# EAGLE board MCU (EAGLE 8.7.1)
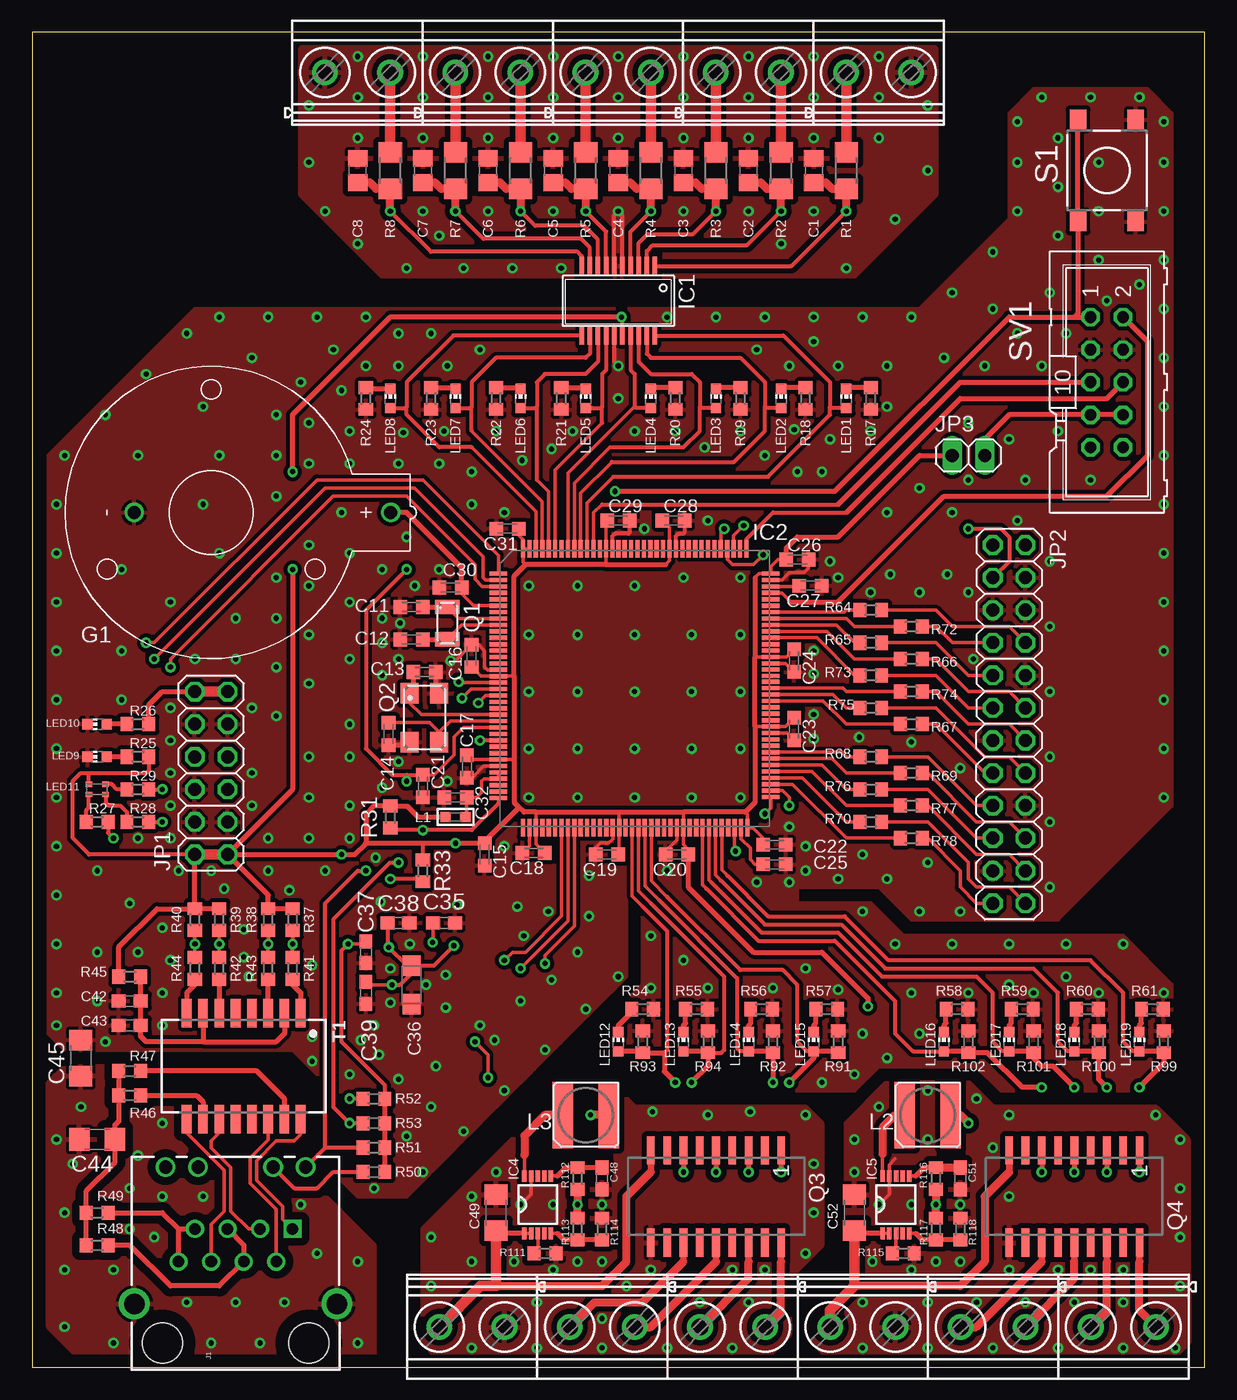
[diagram p6: board, top side]
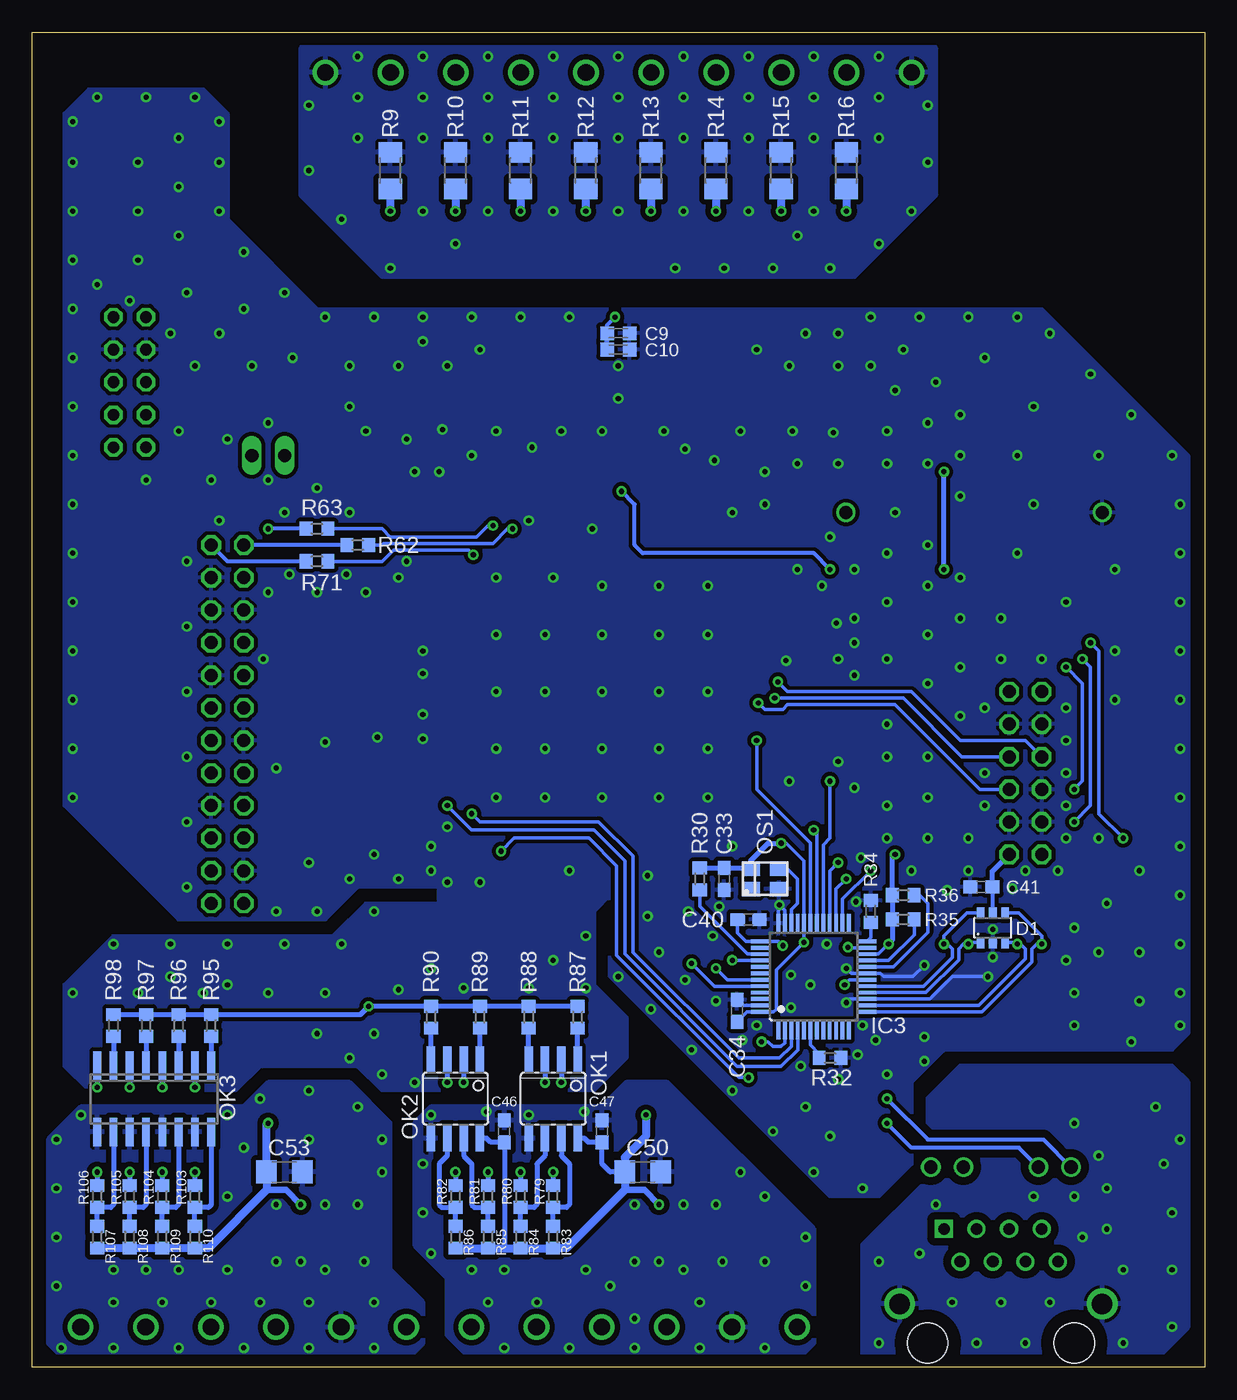
[diagram p7: board, bottom side, seen from below]

Size 91.44 x 104.14 mm. Coordinates in mm from the lower left corner, seen from the top.
Outline: 0,0 91.44,0 91.44,104.14 0,104.14 0,0
Copper layers (1*16): Top 0.035mm / dielectric 1.5mm / Bottom 0.035mm
Design rules "default *": minimum track width 6mil, minimum drill 0.4mm, track to track 8mil, track to pad 8mil, pad to pad 8mil, via to via 12mil, smd to smd 6mil, copper to edge 1mm, drill to drill 10mil, minimum pad ring 10mil, minimum via ring 8mil, stop-mask expansion 4mil, vias tented up to drill 0mil, thermal gap 10mil
Net classes: 0 default: width 0.254 mm; 1 diff pair: width 0.254 mm, clearance 0.254 mm

## Footprints (pad centres in the part's own frame; a part is rotated, then mirrored left to right if it is on the bottom)
C0805 = smd 1.3 x 1.5: 1 -0.95,0; 2 0.95,0
C0603K = smd 1.05 x 1.08: 1 -0.875,0; 2 0.875,0
C0603 = smd 1.1 x 1: 1 -0.85,0; 2 0.85,0
SMC_A = smd 1.6 x 1.4: + -1.5,0; - 1.5,0
C1206 = smd 1.6 x 1.8: 1 -1.4,0; 2 1.4,0
SOT23-6 = smd 0.6 x 0.9: 1 -0.95,-1.15; 2 0,-1.15; 3 0.95,-1.15; 4 0.95,1.15; 5 0,1.15; 6 -0.95,1.15
CH25-2032LF = drill 1: + 0,-14; - 0,6
QSOP-20 = smd 0.35 x 1.45: 1 -2.857,-2.7; 2 -2.222,-2.7; 3 -1.587,-2.7; 4 -0.952,-2.7; 5 -0.317,-2.7; 6 0.318,-2.7; 7 0.953,-2.7; 8 1.588,-2.7; 9 2.223,-2.7; 10 2.858,-2.7; 11 2.857,2.7; 12 2.222,2.7; 13 1.587,2.7; 14 0.952,2.7; 15 0.317,2.7; 16 -0.318,2.7; 17 -0.953,2.7; 18 -1.588,2.7; 19 -2.223,2.7; 20 -2.858,2.7
LQFP144 = smd 1.35 x 0.33: 1 -10.625,9.2; 2 -10.625,8.7; 3 -10.625,8.2; 4 -10.625,7.7; 5 -10.625,7.2; 6 -10.625,6.7; 7 -10.625,6.2; 8 -10.625,5.7; 9 -10.625,5.2; 10 -10.625,4.7; 11 -10.625,4.2; 12 -10.625,3.7; 13 -10.625,3.2; 14 -10.625,2.7; 15 -10.625,2.2; 16 -10.625,1.7; 17 -10.625,1.2; 18 -10.625,0.7; 19 -10.625,0.2; 20 -10.625,-0.3; 21 -10.625,-0.8; 22 -10.625,-1.3; 23 -10.625,-1.8; 24 -10.625,-2.3; 25 -10.625,-2.8; 26 -10.625,-3.3; 27 -10.625,-3.8; 28 -10.625,-4.3; 29 -10.625,-4.8; 30 -10.625,-5.3; 31 -10.625,-5.8; 32 -10.625,-6.3; 33 -10.625,-6.8; 34 -10.625,-7.3; 35 -10.625,-7.8; 36 -10.625,-8.3; 73 10.625,-8.225; 74 10.625,-7.725; 75 10.625,-7.225; 76 10.625,-6.725; 77 10.625,-6.225; 78 10.625,-5.725; 79 10.625,-5.225; 80 10.625,-4.725; 81 10.625,-4.225; 82 10.625,-3.725; 83 10.625,-3.225; 84 10.625,-2.725; 85 10.625,-2.225; 86 10.625,-1.725; 87 10.625,-1.225; 88 10.625,-0.725; 89 10.625,-0.225; 90 10.625,0.275; 91 10.625,0.775; 92 10.625,1.225; 93 10.625,1.725; 94 10.625,2.2; 95 10.625,2.7; 96 10.625,3.2; 97 10.625,3.7; 98 10.625,4.2; 99 10.625,4.7; 100 10.625,5.2; 101 10.625,5.7; 102 10.625,6.2; 103 10.625,6.7; 104 10.625,7.2; 105 10.625,7.7; 106 10.625,8.2; 107 10.625,8.7; 108 10.625,9.2 | smd 0.33 x 1.35: 37 -8.7,-10.625; 38 -8.2,-10.625; 39 -7.7,-10.625; 40 -7.2,-10.625; 41 -6.7,-10.625; 42 -6.2,-10.625; 43 -5.7,-10.625; 44 -5.2,-10.625; 45 -4.7,-10.625; 46 -4.2,-10.625; 47 -3.7,-10.625; 48 -3.2,-10.625; 49 -2.7,-10.625; 50 -2.2,-10.625; 51 -1.7,-10.625; 52 -1.2,-10.625; 53 -0.7,-10.625; 54 -0.2,-10.625; 55 0.3,-10.625; 56 0.8,-10.625; 57 1.3,-10.625; 58 1.8,-10.625; 59 2.3,-10.625; 60 2.8,-10.625; 61 3.3,-10.625; 62 3.8,-10.625; 63 4.3,-10.625; 64 4.8,-10.625; 65 5.3,-10.625; 66 5.8,-10.625; 67 6.3,-10.625; 68 6.8,-10.625; 69 7.3,-10.625; 70 7.8,-10.625; 71 8.3,-10.625; 72 8.8,-10.625; 109 8.725,11.125; 110 8.225,11.125; 111 7.725,11.125; 112 7.225,11.125; 113 6.725,11.125; 114 6.225,11.125; 115 5.725,11.125; 116 5.225,11.125; 117 4.725,11.125; 118 4.225,11.125; 119 3.725,11.125; 120 3.225,11.125; 121 2.725,11.125; 122 2.225,11.125; 123 1.725,11.125; 124 1.225,11.125; 125 0.725,11.125; 126 0.225,11.125; 127 -0.275,11.125; 128 -0.775,11.125; 129 -1.275,11.125; 130 -1.725,11.125; 131 -2.225,11.125; 132 -2.7,11.125; 133 -3.2,11.125; 134 -3.7,11.125; 135 -4.2,11.125; 136 -4.7,11.125; 137 -5.2,11.125; 138 -5.7,11.125; 139 -6.2,11.125; 140 -6.7,11.125; 141 -7.2,11.125; 142 -7.7,11.125; 143 -8.2,11.125; 144 -8.7,11.125
LQFP48 = smd 1.5 x 0.3: 1 -4.15,2.75; 2 -4.15,2.25; 3 -4.15,1.75; 4 -4.15,1.25; 5 -4.15,0.75; 6 -4.15,0.25; 7 -4.15,-0.25; 8 -4.15,-0.75; 9 -4.15,-1.25; 10 -4.15,-1.75; 11 -4.15,-2.25; 12 -4.15,-2.75; 25 4.15,-2.75; 26 4.15,-2.25; 27 4.15,-1.75; 28 4.15,-1.25; 29 4.15,-0.75; 30 4.15,-0.25; 31 4.15,0.25; 32 4.15,0.75; 33 4.15,1.25; 34 4.15,1.75; 35 4.15,2.25; 36 4.15,2.75 | smd 0.3 x 1.5: 13 -2.75,-4.15; 14 -2.25,-4.15; 15 -1.75,-4.15; 16 -1.25,-4.15; 17 -0.75,-4.15; 18 -0.25,-4.15; 19 0.25,-4.15; 20 0.75,-4.15; 21 1.25,-4.15; 22 1.75,-4.15; 23 2.25,-4.15; 24 2.75,-4.15; 37 2.75,4.15; 38 2.25,4.15; 39 1.75,4.15; 40 1.25,4.15; 41 0.75,4.15; 42 0.25,4.15; 43 -0.25,4.15; 44 -0.75,4.15; 45 -1.25,4.15; 46 -1.75,4.15; 47 -2.25,4.15; 48 -2.75,4.15
TSSOP-10(10UMAX) = smd 0.9 x 0.35: 1 -2.875,0.975; 2 -2.875,0.452; 3 -2.875,-0.071; 4 -2.875,-0.594; 5 -2.875,-1.102; 6 1.605,-1.102; 7 1.605,-0.594; 8 1.605,-0.071; 9 1.605,0.452; 10 1.605,0.975
MAGJACK-19938 = drill 0.9 square: 1 0,0 | drill 0.9: 2 -2.54,1.27; 3 0,2.54; 4 -2.54,3.81; 5 0,5.08; 6 -2.54,6.35; 7 0,7.62; 8 -2.54,8.89 | drill 1.02: 9 4.83,-1.02; 10 4.83,1.52; 11 4.83,7.37; 12 4.83,9.91 | drill 1.6: HOLE1 -5.84,12.345; HOLE2 -5.84,-3.455 | hole 3.15: -8.89,-1.27; -8.89,10.16
2X06 = drill 1.016 octagon: 1 -6.35,-1.27; 2 -6.35,1.27; 3 -3.81,-1.27; 4 -3.81,1.27; 5 -1.27,-1.27; 6 -1.27,1.27; 7 1.27,-1.27; 8 1.27,1.27; 9 3.81,-1.27; 10 3.81,1.27; 11 6.35,-1.27; 12 6.35,1.27
2X12 = drill 1.016 octagon: 1 -13.97,-1.27; 2 -13.97,1.27; 3 -11.43,-1.27; 4 -11.43,1.27; 5 -8.89,-1.27; 6 -8.89,1.27; 7 -6.35,-1.27; 8 -6.35,1.27; 9 -3.81,-1.27; 10 -3.81,1.27; 11 -1.27,-1.27; 12 -1.27,1.27; 13 1.27,-1.27; 14 1.27,1.27; 15 3.81,-1.27; 16 3.81,1.27; 17 6.35,-1.27; 18 6.35,1.27; 19 8.89,-1.27; 20 8.89,1.27; 21 11.43,-1.27; 22 11.43,1.27; 23 13.97,-1.27; 24 13.97,1.27
1X02 = drill 1.016 long: 1 -1.27,0; 2 1.27,0
L0603 = smd 0.8 x 0.8: 1 -0.762,0; 2 0.762,0
SRR4528A = smd 1.6 x 5.2: 1 -1.8,0; 2 1.8,0
CHIP-LED0603 = smd 0.8 x 0.8: A 0,-0.75; C 0,0.75
APHF1608SEEQBDZGKC = smd 0.4 x 0.5: 1 0.4,0.65; 2 -0.4,0.65; 3 -0.4,-0.65; 4 0.4,-0.65
SOIC08 = smd 0.66 x 2.032: 1 -1.905,-3.073; 2 -0.635,-3.073; 3 0.635,-3.073; 4 1.905,-3.073; 5 1.905,3.073; 6 0.635,3.073; 7 -0.635,3.073; 8 -1.905,3.073
SO16 = smd 0.6 x 2.2: 1 -4.445,-2.6; 2 -3.175,-2.6; 3 -1.905,-2.6; 4 -0.635,-2.6; 5 0.635,-2.6; 6 1.905,-2.6; 7 3.175,-2.6; 8 4.445,-2.6; 9 4.445,2.6; 10 3.175,2.6; 11 1.905,2.6; 12 0.635,2.6; 13 -0.635,2.6; 14 -1.905,2.6; 15 -3.175,2.6; 16 -4.445,2.6
3.4X2.7-4-PAD = smd 1.4 x 1.15: 1 -1.1,-0.8; 2 1.1,-0.8; 3 1.1,0.8; 4 -1.1,0.8
CRYSTAL_3.5X1.5 = smd 1.1 x 1.9: 1 -1.25,0; 2 1.25,0
CRYSTAL_5X3.2 = smd 1.6 x 1.4: 1 -1.9,-1.15; 2 1.91,-1.15; 3 1.91,1.15; 4 -1.9,1.15
SOP18 = smd 0.6 x 2.2: 1 -5.08,-3.6; 2 -3.81,-3.6; 3 -2.54,-3.6; 4 -1.27,-3.6; 5 0,-3.6; 6 1.27,-3.6; 7 2.54,-3.6; 8 3.81,-3.6; 9 5.08,-3.6; 10 5.08,3.6; 11 3.81,3.6; 12 2.54,3.6; 13 1.27,3.6; 14 0,3.6; 15 -1.27,3.6; 16 -2.54,3.6; 17 -3.81,3.6; 18 -5.08,3.6
R1206 = smd 1.6 x 1.803: 1 -1.422,0; 2 1.422,0
R0603 = smd 1 x 1.1: 1 -0.85,0; 2 0.85,0
DTSM-6 = smd 1.55 x 1.3: 1 -3.975,2.25; 2 3.975,2.25; 3 -3.975,-2.25; 4 3.975,-2.25
ML10 = drill 0.914 octagon: 1 -5.08,-1.27; 2 -5.08,1.27; 3 -2.54,-1.27; 4 -2.54,1.27; 5 0,-1.27; 6 0,1.27; 7 2.54,-1.27; 8 2.54,1.27; 9 5.08,-1.27; 10 5.08,1.27
HXXXX = smd 0.76 x 2.2: 1 -4.445,-4.128; 2 -3.175,-4.128; 3 -1.905,-4.128; 4 -0.635,-4.128; 5 0.635,-4.128; 6 1.905,-4.128; 7 3.175,-4.128; 8 4.445,-4.128; 9 4.445,4.128; 10 3.175,4.128; 11 1.905,4.128; 12 0.635,4.128; 13 -0.635,4.128; 14 -1.905,4.128; 15 -3.175,4.128; 16 -4.445,4.128
MKDSN1,5/2-5,08 = drill 1.3 pad 2: 1 -2.561,0.025; 2 2.519,0.025

## Placement (x,y rotation side)
C1  2.2nF  [C0805]  60.96,93.34 90 top
C2  2.2nF  [C0805]  55.88,93.34 90 top
C3  2.2nF  [C0805]  50.8,93.34 90 top
C4  2.2nF  [C0805]  45.72,93.34 90 top
C5  2.2nF  [C0805]  40.64,93.34 90 top
C6  2.2nF  [C0805]  35.56,93.34 90 top
C7  2.2nF  [C0805]  30.48,93.34 90 top
C8  2.2nF  [C0805]  25.4,93.34 90 top
C9  100nF  [C0603K]  45.72,80.64 0 bottom
C10  1uF  [C0603K]  45.72,79.38 0 bottom
C11  10pF  [C0603K]  29.59,59.31 180 top
C12  10pF  [C0603K]  29.59,56.77 180 top
C13  22pF  [C0603K]  30.61,54.23 0 top
C14  22pF  [C0603K]  27.81,49.4 270 top
C15  4.7uF  [C0603K]  35.31,40.01 270 top
C16  100nF  [C0603K]  34.29,55.5 90 top
C17  100nF  [C0603K]  33.91,46.86 270 top
C18  100nF  [C0603K]  39.12,40.13 180 top
C19  100nF  [C0603K]  44.83,40.01 180 top
C20  100nF  [C0603K]  50.29,40.01 180 top
C21  100nF  [C0603K]  30.48,45.34 270 top
C22  100nF  [C0603K]  57.91,40.77 0 top
C23  100nF  [C0603K]  59.44,49.78 270 top
C24  100nF  [C0603K]  59.44,55.12 270 top
C25  2.2uF  [C0603K]  57.91,39.24 180 top
C26  100nF  [C0603K]  59.69,62.99 0 top
C27  2.2uF  [C0603K]  60.71,60.96 180 top
C28  100nF  [C0603K]  50.04,66.04 0 top
C29  100nF  [C0603K]  45.72,66.04 0 top
C30  1uF  [C0603K]  32.64,60.83 180 top
C31  100nF  [C0603K]  37.08,65.41 180 top
C32  100nF  [C0603K]  33.02,44.45 180 top
C33  100nF  [C0603]  37.47,38.1 270 bottom
C34  100nF  [C0603]  36.45,27.81 90 bottom
C35  100nF  [C0603]  32.13,34.67 0 top
C36  10uF  [SMC_A]  29.59,29.84 270 top
C37  100nF  [C0603]  26.04,32.38 270 top
C38  100nF  [C0603]  28.57,34.67 0 top
C39  100nF  [C0603]  26.04,29.21 270 top
C40  100nF  [C0603]  35.56,34.92 0 bottom
C41  100nF  [C0603]  17.4,37.47 180 bottom
C42  100nF  [C0603]  7.62,28.57 180 top
C43  100nF  [C0603]  7.62,26.67 180 top
C44  1nF, 2kV  [C1206]  5.08,17.78 180 top
C45  1nF, 2kV  [C1206]  3.81,24.13 270 top
C46  100nF  [C0603]  54.61,18.41 90 bottom
C47  100nF  [C0603]  46.99,18.41 90 bottom
C48  0,22uF  [C0603]  44.45,14.73 270 top
C49  1uF/50V  [C1206]  36.2,12.06 90 top
C50  10uF/6,3V  [C1206]  43.81,15.24 0 bottom
C51  0,22uF  [C0603]  72.39,14.73 270 top
C52  1uF/50V  [C1206]  64.14,12.06 90 top
C53  10uF/6,3V  [C1206]  71.75,15.24 0 bottom
D1  USBLC6-4SC6  [SOT23-6]  16.51,34.29 0 bottom
G1  CH25-2032LF  [CH25-2032LF]  13.97,66.67 90 top
IC1  SI8382P-IU  [QSOP-20]  45.72,83.19 180 top
IC2  [LQFP144]  46.99,52.7 0 top
IC3  DP83848  [LQFP48]  30.48,30.48 90 bottom
IC4  MAX17552  [TSSOP-10(10UMAX)]  39.37,13.34 90 top
IC5  MAX17552  [TSSOP-10(10UMAX)]  67.31,13.34 90 top
J1  RJHSE-5381  [MAGJACK-19938]  20.32,10.79 90 top
JP1  [2X06]  13.97,46.35 90 top
JP2  [2X12]  76.2,50.16 270 top
JP3  [1X02]  73.03,71.12 0 top
L1  600R  [L0603]  33.02,42.93 180 top
L2  220uH  [SRR4528A]  69.85,19.68 0 top
L3  220uH  [SRR4528A]  43.18,19.68 0 top
LED1  [CHIP-LED0603]  63.5,75.56 0 top
LED2  [CHIP-LED0603]  58.42,75.56 0 top
LED3  [CHIP-LED0603]  53.34,75.56 0 top
LED4  [CHIP-LED0603]  48.26,75.56 0 top
LED5  [CHIP-LED0603]  43.18,75.56 0 top
LED6  [CHIP-LED0603]  38.1,75.56 0 top
LED7  [CHIP-LED0603]  33.02,75.56 0 top
LED8  [CHIP-LED0603]  27.94,75.56 0 top
LED9  [CHIP-LED0603]  5.08,47.62 90 top
LED10  [CHIP-LED0603]  5.08,50.16 90 top
LED11  APHF1608SEEQBDZGKC  [APHF1608SEEQBDZGKC]  5.08,45.09 90 top
LED12  [CHIP-LED0603]  45.72,25.4 0 top
LED13  [CHIP-LED0603]  50.8,25.4 0 top
LED14  [CHIP-LED0603]  55.88,25.4 0 top
LED15  [CHIP-LED0603]  60.96,25.4 0 top
LED16  [CHIP-LED0603]  71.12,25.4 0 top
LED17  [CHIP-LED0603]  76.2,25.4 0 top
LED18  [CHIP-LED0603]  81.28,25.4 0 top
LED19  [CHIP-LED0603]  86.36,25.4 0 top
OK1  HCPL0531  [SOIC08]  50.8,20.95 180 bottom
OK2  HCPL0531  [SOIC08]  58.42,20.95 180 bottom
OK3  TLP291-4  [SO16]  81.92,20.95 180 bottom
OS1  CFPS-39-CFPS-39  [3.4X2.7-4-PAD]  34.29,38.1 0 bottom
Q1  32.768kHz  [CRYSTAL_3.5X1.5]  32.38,58.04 270 top
Q2  CRYSTAL_SHIELD  [CRYSTAL_5X3.2]  30.61,50.67 270 top
Q3  MIC2981/82  [SOP18]  53.34,13.34 180 top
Q4  MIC2981/82  [SOP18]  81.28,13.34 180 top
R1  6.2k  [R1206]  63.5,93.34 270 top
R2  6.2k  [R1206]  58.42,93.34 270 top
R3  6.2k  [R1206]  53.34,93.34 270 top
R4  6.2k  [R1206]  48.26,93.34 270 top
R5  6.2k  [R1206]  43.18,93.34 270 top
R6  6.2k  [R1206]  38.1,93.34 270 top
R7  6.2k  [R1206]  33.02,93.34 270 top
R8  6.2k  [R1206]  27.94,93.34 270 top
R9  2.4k  [R1206]  63.5,93.34 270 bottom
R10  2.4k  [R1206]  58.42,93.34 270 bottom
R11  2.4k  [R1206]  53.34,93.34 270 bottom
R12  2.4k  [R1206]  48.26,93.34 270 bottom
R13  2.4k  [R1206]  43.18,93.34 270 bottom
R14  2.4k  [R1206]  38.1,93.34 270 bottom
R15  2.4k  [R1206]  33.02,93.34 270 bottom
R16  2.4k  [R1206]  27.94,93.34 270 bottom
R17  1.2k  [R0603]  65.41,75.56 270 top
R18  1.2k  [R0603]  60.33,75.56 270 top
R19  1.2k  [R0603]  55.24,75.56 270 top
R20  1.2k  [R0603]  50.16,75.56 270 top
R21  1.2k  [R0603]  41.27,75.56 270 top
R22  1.2k  [R0603]  36.2,75.56 270 top
R23  1.2k  [R0603]  31.11,75.56 270 top
R24  1.2k  [R0603]  26.04,75.56 270 top
R25  1.2k  [R0603]  8.26,47.62 180 top
R26  22k  [R0603]  8.26,50.16 180 top
R27  1.2k  [R0603]  5.08,42.55 0 top
R28  1.2k  [R0603]  8.26,42.55 0 top
R29  1.2k  [R0603]  8.26,45.09 0 top
R30  2K2  [R0603]  39.37,38.1 90 bottom
R31  1K5  [R0603]  27.94,42.93 270 top
R32  2K2  [R0603]  29.21,24.13 180 bottom
R33  2K2  [R0603]  30.48,38.73 90 top
R34  4K87, 1%  [R0603]  26.04,35.56 90 bottom
R35  2K2  [R0603]  23.5,34.92 180 bottom
R36  2K2  [R0603]  23.5,36.83 180 bottom
R37  49.9R  [R0603]  20.32,34.92 90 top
R38  49.9R  [R0603]  18.41,34.92 90 top
R39  49.9R  [R0603]  14.61,34.92 90 top
R40  49.9R  [R0603]  12.7,34.92 90 top
R41  0R  [R0603]  20.32,31.11 270 top
R42  0R  [R0603]  14.61,31.11 270 top
R43  0R  [R0603]  18.41,31.11 270 top
R44  0R  [R0603]  12.7,31.11 270 top
R45  0R  [R0603]  7.62,30.48 180 top
R46  75R  [R0603]  7.62,21.21 0 top
R47  75R  [R0603]  7.62,23.11 0 top
R48  75R  [R0603]  5.08,9.53 0 top
R49  75R  [R0603]  5.08,12.06 0 top
R50  110R  [R0603]  26.67,15.24 0 top
R51  2K2  [R0603]  26.67,17.14 0 top
R52  110R  [R0603]  26.67,20.95 0 top
R53  2K2  [R0603]  26.67,19.05 0 top
R54  1.2k  [R0603]  47.62,27.94 0 top
R55  1.2k  [R0603]  51.82,27.94 0 top
R56  1.2k  [R0603]  56.9,27.94 0 top
R57  1.2k  [R0603]  61.98,27.94 0 top
R58  1.2k  [R0603]  72.14,27.94 0 top
R59  1.2k  [R0603]  77.22,27.94 0 top
R60  1.2k  [R0603]  82.3,27.94 0 top
R61  1.2k  [R0603]  87.38,27.94 0 top
R62  33R  [R0603]  66.04,64.14 180 bottom
R63  33R  [R0603]  69.22,65.41 180 bottom
R64  33R  [R0603]  68.58,57.78 0 top
R65  33R  [R0603]  65.41,56.52 0 top
R66  33R  [R0603]  65.41,53.98 0 top
R67  33R  [R0603]  68.58,50.16 0 top
R68  33R  [R0603]  65.41,47.62 0 top
R69  33R  [R0603]  65.41,45.09 0 top
R70  33R  [R0603]  68.58,41.27 0 top
R71  33R  [R0603]  69.22,62.87 0 bottom
R72  33R  [R0603]  65.41,59.05 180 top
R73  33R  [R0603]  68.58,55.24 180 top
R74  33R  [R0603]  68.58,52.7 180 top
R75  33R  [R0603]  65.41,51.44 180 top
R76  33R  [R0603]  68.58,46.35 180 top
R77  33R  [R0603]  68.58,43.81 180 top
R78  33R  [R0603]  65.41,42.55 180 top
R79  300R  [R0603]  50.8,13.34 90 bottom
R80  300R  [R0603]  53.34,13.34 90 bottom
R81  300R  [R0603]  55.88,13.34 90 bottom
R82  300R  [R0603]  58.42,13.34 90 bottom
R83  523R  [R0603]  50.8,10.16 270 bottom
R84  523R  [R0603]  53.34,10.16 270 bottom
R85  523R  [R0603]  55.88,10.16 270 bottom
R86  523R  [R0603]  58.42,10.16 270 bottom
R87  210R  [R0603]  48.9,27.3 270 bottom
R88  210R  [R0603]  52.7,27.3 270 bottom
R89  210R  [R0603]  56.52,27.3 270 bottom
R90  210R  [R0603]  60.33,27.3 270 bottom
R91  2k7  [R0603]  62.87,25.4 270 top
R92  2k7  [R0603]  57.78,25.4 270 top
R93  2k7  [R0603]  47.62,25.4 270 top
R94  2k7  [R0603]  52.7,25.4 270 top
R95  210R  [R0603]  77.47,26.67 270 bottom
R96  210R  [R0603]  80.01,26.67 270 bottom
R97  210R  [R0603]  82.55,26.67 270 bottom
R98  210R  [R0603]  85.09,26.67 270 bottom
R99  2k7  [R0603]  88.27,25.4 270 top
R100  2k7  [R0603]  83.19,25.4 270 top
R101  2k7  [R0603]  78.11,25.4 270 top
R102  2k7  [R0603]  73.03,25.4 270 top
R103  300R  [R0603]  78.74,13.34 90 bottom
R104  300R  [R0603]  81.28,13.34 90 bottom
R105  300R  [R0603]  83.82,13.34 90 bottom
R106  300R  [R0603]  86.36,13.34 90 bottom
R107  523R  [R0603]  86.36,10.16 270 bottom
R108  523R  [R0603]  83.82,10.16 270 bottom
R109  523R  [R0603]  81.28,10.16 270 bottom
R110  523R  [R0603]  78.74,10.16 270 bottom
R111  191k  [R0603]  40.01,8.89 180 top
R112  22k1  [R0603]  42.55,14.73 270 top
R113  261k  [R0603]  42.55,10.79 90 top
R114  49k9  [R0603]  44.45,10.79 270 top
R115  191k  [R0603]  67.94,8.89 180 top
R116  22k1  [R0603]  70.48,14.73 270 top
R117  261k  [R0603]  70.48,10.79 90 top
R118  49k9  [R0603]  72.39,10.79 270 top
S1  DTSM-6  [DTSM-6]  83.82,93.34 270 top
SV1  [ML10]  83.82,76.83 270 top
T1  H1102NL  [HXXXX]  16.51,23.5 180 top
X1  MKDSN1,5/2-5,08  [MKDSN1,5/2-5,08]  25.4,100.97 0 top
X2  MKDSN1,5/2-5,08  [MKDSN1,5/2-5,08]  35.56,100.97 0 top
X3  MKDSN1,5/2-5,08  [MKDSN1,5/2-5,08]  45.72,100.97 0 top
X4  MKDSN1,5/2-5,08  [MKDSN1,5/2-5,08]  34.29,3.17 180 top
X5  MKDSN1,5/2-5,08  [MKDSN1,5/2-5,08]  44.45,3.17 180 top
X6  MKDSN1,5/2-5,08  [MKDSN1,5/2-5,08]  54.61,3.17 180 top
X7  MKDSN1,5/2-5,08  [MKDSN1,5/2-5,08]  64.77,3.17 180 top
X8  MKDSN1,5/2-5,08  [MKDSN1,5/2-5,08]  74.93,3.17 180 top
X9  MKDSN1,5/2-5,08  [MKDSN1,5/2-5,08]  85.09,3.17 180 top
X10  MKDSN1,5/2-5,08  [MKDSN1,5/2-5,08]  55.88,100.97 0 top
X11  MKDSN1,5/2-5,08  [MKDSN1,5/2-5,08]  66.04,100.97 0 top

## Tracks (layer width: path | path; a pad name or v marks a point on that pad's centre or on a via)
5-24V1
  Top 0.254: IC4.2 IC4.1
  Top 0.406: IC4.1 36.4,10.46 C49.1
  Top 0.508: 48.26,15.24 Q3.9
  Top 0.61: 36.2,6.35 44.45,6.35 46.35,8.26 46.35,13.34 48.26,15.24
  Top 0.813: C49.1 36.2,6.35 34.97,6.35 X4.2
5-24V2
  Top 0.254: IC5.1 IC5.2
  Top 0.305: 64.34,10.46 C52.1
  Top 0.406: IC5.1 64.34,10.46
  Top 0.508: Q4.9 76.2,15.24
  Top 0.61: 76.2,15.24 74.3,13.34 74.3,8.26 72.39,6.35 64.14,6.35
  Top 0.813: C52.1 64.14,6.35 62.23,4.45 62.23,3.17 X7.2
5V1  (via drill 0.4)
  Top 0.61: R113.2 v42.55,12.7 R112.2 | L3.2 v43.56,19.68
  Bottom 0.406: 54.61,9.31 C46.1 55.66,17.57 55.98,17.88 OK2.8 | C50.1 46.35,15.24 46.99,15.88 C47.1 48.05,17.57 48.36,17.88 OK1.8
  Bottom 0.508: 45.22,13.84 43.69,13.84 v42.55,12.7
  Bottom 0.61: R86.2 R85.2 54.61,9.31 R84.2 R83.2 49.74,9.31 45.22,13.84 C50.1 45.22,16.38 43.56,18.03 v43.56,19.68
5V2  (via drill 0.4)
  Top 0.61: R116.2 v70.48,12.7 R117.2 | L2.2 72.39,19.68 v73.03,19.05
  Bottom 0.508: 73.16,13.84 71.62,13.84 v70.48,12.7
  Bottom 0.61: R107.2 R108.2 R109.2 R110.2 77.69,9.31 73.16,13.84 C53.1 73.16,18.92 v73.03,19.05
+3V3  (via drill 0.4)
  Top 0.254: C18.1 39.29,40.83 IC2.39 39.29,43.31 | C22.1 57.04,41.26 56.22,42.08 IC2.72 55.79,43.14 55.63,43.31 | 49.4,62.61 49.72,62.92 IC2.121 49.72,65.49 C28.1 | IC2.144 38.29,62.8 38.48,62.61 | IC2.143 IC2.144 | 50.8,43.31 50.79,43.3 IC2.62 50.79,40.78 51.17,40.4 | 45.72,43.31 45.79,43.24 IC2.52 45.79,40.09 C19.1 | 37.59,47.41 IC2.30 34.24,47.41 C17.1 | 37.59,53.91 IC2.17 35.01,53.91 C16.1 | 44.77,62.61 IC2.131 44.77,65.96 C29.1 | 56.39,55.41 IC2.95 58.85,55.41 C24.1 | 56.39,49.98 IC2.84 58.76,49.98 C23.1 | 56.39,61.59 56.7,61.91 IC2.108 57.62,62.44 58.17,62.99 C26.1 | C37.1 25.82,33.02 v24.64,33.02 | C35.1 31.28,33.19 v31.24,33.15 | IC2.144 38.29,64.58 37.96,64.91 C31.1
  Top 0.305: IC1.16 46.04,81.85 v45.97,81.92 | R52.2 27.52,22.01 24.13,25.4 24.13,32.51 v24.64,33.02 | 51.17,40.4 C20.1 | R33.2 30.48,40.88 | R25.1 9.11,46.57 8.89,46.35 4.45,46.35 | 4.45,46.35 3.81,46.35 3.17,45.72 3.17,41.27 4.45,40.01 JP1.2 | LED11.1 4.43,46.34 4.45,46.35
  Top 0.406: 37.97,43.69 38.35,43.31 39.29,43.31 45.72,43.31 50.8,43.31 55.63,43.31 56.39,44.07 56.39,49.98 56.39,55.41 56.39,61.59 | 37.97,43.69 37.59,44.07 37.59,47.41 37.59,53.91 37.59,61.72 38.48,62.61 44.77,62.61 49.4,62.61 | C26.1 58.81,63.9 59.69,64.77 62.87,64.77 69.22,71.12 JP3.1 | v45.97,81.92 27.94,81.92 20.32,74.3 v20.32,69.85 | L1.2 30.1,42.93 29.25,43.78 R31.1 26.63,43.78 26.04,43.18 26.04,40.88 | R50.2 R51.2 R53.2 R52.2 | R39.2 R40.2 | R37.2 R38.2 18.41,36.83 JP1.1 | R45.2 6.77,32.8 9.74,35.77 R40.2 | 35.07,40.64 C15.1 | 37.97,43.69 35.31,41.02 C15.1 | C15.1 v33.02,40.88 30.48,40.88 26.04,40.88 | 26.04,40.88 26.01,40.88 | JP1.1 v24.13,40.01 25.16,40.01 26.04,40.88 | JP1.1 20.32,45.09 v20.32,62.23 | R40.2 JP1.2 | C20.1 51.17,37.48 56.26,32.38 61.59,32.38 65.19,28.79 v65.19,28.16
  Top 0.813: JP1.1 JP1.2
  Bottom 0.254: C34.1 35.68,27.73 IC3.48 33.61,27.73 33.4,27.94 33.4,30.99 v31.24,33.15 v31.23,33.16 IC3.32 31.23,39.48 32.62,40.88 v33.02,40.88 | IC3.22 25.43,32.23 v24.64,33.02
  Bottom 0.305: C9.1 46.59,81.29 v45.97,81.92 | D1.5 16.51,37.43 C41.1
  Bottom 0.406: R30.2 C33.1 35.44,38.95 OS1.4 35.39,39.54 34.05,40.88 v33.02,40.88 | v24.64,33.02 24.34,33.31 R35.2 R36.2 24.34,39.79 v24.13,40.01 | C10.1 C9.1 | v20.32,62.23 v20.32,69.85 | C41.1 16.55,38.7 JP1.1 | R87.1 R88.1 R89.1 R90.1 v65.19,28.16 65.83,27.52 R95.1 R96.1 R97.1 R98.1
+24V
  Top 0.406: R26.1 9.11,51.65 10.16,52.7 JP1.12
  Top 0.813: JP1.11 JP1.12
COM  (via drill 0.4)
  Top 0.305: IC1.6 45.4,89.85 v45.72,90.17 46.04,89.85 IC1.5
  other vias: 25.4,95.89 41.27,85.72 37.47,85.72 33.66,85.72 29.21,85.72 25.4,87.63 22.86,90.17 21.59,93.98 30.48,95.89 35.56,95.89 40.64,95.89 45.72,95.89 50.8,95.89 55.88,95.89 60.96,95.89 21.59,98.42 25.4,99.06 30.48,99.06 35.56,99.06 40.64,99.06 45.72,99.06 50.8,99.06 55.88,99.06 60.96,99.06 60.96,90.17 55.88,90.17 50.8,90.17 40.64,90.17 35.56,90.17 30.48,90.17 58.42,87.63 31.75,88.27 67.31,89.53 63.5,85.72 69.85,93.34 66.04,95.89 66.04,99.06 69.85,98.42 66.04,102.23 60.96,102.23 55.88,102.23 50.8,102.23 45.72,102.23 40.64,102.23 35.56,102.23 30.48,102.23 25.4,102.23
  pour Top (isolate 0.406): 70.48,102.87 70.48,91.44 64.14,85.09 27.3,85.09 20.95,91.44 20.95,102.87 22.23,104.14 69.22,104.14
  pour Bottom (isolate 0.406): 70.48,102.87 70.48,91.44 64.14,85.09 27.3,85.09 20.95,91.44 20.95,102.87 22.23,104.14 69.22,104.14
CS_AI1_4
  Top 0.254: IC2.88 61.69,51.98 63.5,50.16 R67.1
CS_AI1_8
  Top 0.254: IC2.89 62.45,52.48 63.5,51.44 R75.2
CS_AI2_4
  Top 0.254: IC2.90 63.23,52.98 63.5,52.7 R74.2
CS_AI2_8
  Top 0.254: IC2.98 61.2,56.91 64.14,53.98 R66.1
CS_AO1_4
  Top 0.254: IC2.99 61.98,57.41 64.14,55.24 R73.2
CS_AO1_8
  Top 0.254: IC2.100 62.74,57.91 64.14,56.52 R65.1
CS_AO2_4
  Top 0.254: IC2.102 63.35,58.91 63.5,59.05 R72.2
CS_AO2_8
  Top 0.254: IC2.101 63.52,58.41 64.14,57.78 R64.1
CS_DI1
  Top 0.254: IC2.75 59.3,45.48 63.5,41.27 R70.1
CS_DI2
  Top 0.254: IC2.77 60.84,46.48 63.5,43.81 R77.2
CS_DO1
  Top 0.254: IC2.79 62.38,47.48 63.5,46.35 R76.2
CS_DO2
  Top 0.254: IC2.80 63.15,47.98 63.5,47.62 R68.1
DI1_INT
  Top 0.254: IC2.76 60.06,45.98 63.5,42.55 R78.2
DI2_INT
  Top 0.254: IC2.78 61.6,46.98 63.5,45.09 R69.1
DI_0
  Top 0.254: IC2.134 43.29,67.42 45.34,69.47
  Top 0.305: IC1.20 58.58,80.48 62.23,76.83 62.23,74.93 | LED1.A 62.34,74.81 62.23,74.93 | 45.34,69.47 57.4,69.47 62.23,74.3 62.23,74.93
DI_1
  Top 0.254: IC2.135 42.79,68.19 45.21,70.61
  Top 0.305: IC1.19 47.94,79.06 48.26,78.74 55.24,78.74 57.15,76.83 57.15,74.93 | LED2.A 57.27,74.81 57.15,74.93 | 45.21,70.61 54.74,70.61 57.15,73.03 57.15,74.93
DI_2
  Top 0.254: IC2.136 42.29,68.96 45.09,71.75
  Top 0.305: IC1.18 47.31,78.42 48.26,77.47 51.44,77.47 52.07,76.83 52.07,74.93 | LED3.A 52.19,74.81 52.07,74.93 | 45.09,71.75 50.8,71.75 52.07,73.03 52.07,74.93
DI_3
  Top 0.254: IC2.137 41.79,69.73 46.99,74.93
  Top 0.305: IC1.17 46.67,77.79 46.99,77.47 46.99,74.93 47.1,74.81 LED4.A
DI_4
  Top 0.254: IC2.139 40.79,70 44.45,73.66
  Top 0.305: IC1.14 44.77,77.79 44.45,77.47 44.45,74.93 | 43.7,74.81 LED5.A 44.34,74.81 44.45,74.93 | 44.45,73.66 44.45,74.93
DI_5
  Top 0.254: IC2.140 40.29,68.3 39.37,69.22
  Top 0.305: IC1.13 44.13,78.42 43.18,77.47 40.01,77.47 39.37,76.83 39.37,74.93 | LED6.A 39.26,74.81 39.37,74.93 | 39.37,69.22 39.37,74.93
DI_6
  Top 0.254: IC2.141 39.79,67.53 34.29,73.03
  Top 0.305: IC1.12 43.5,79.06 43.18,78.74 36.2,78.74 34.29,76.83 34.29,74.93 | LED7.A 34.17,74.81 34.29,74.93 | 34.29,73.03 34.29,74.93
DI_7
  Top 0.254: 34.29,71.75 39.29,66.75 IC2.142
  Top 0.305: IC1.11 32.86,80.48 29.21,76.83 29.21,74.93 | LED8.A 29.09,74.81 29.21,74.93 | 29.21,74.93 29.21,74.3 31.75,71.75 34.29,71.75
DMX_DIR  (via drill 0.4)
  Top 0.254: IC2.20 35.39,52.41 v34.8,51.82
  Bottom 0.254: v34.8,51.82 34.29,51.31 32.89,51.31 32.51,51.69 24.13,51.69 17.53,45.09 JP1.5
DMX_RX  (via drill 0.4)
  Top 0.254: IC2.18 33.34,53.41 v33.27,53.47
  Bottom 0.254: v33.27,53.47 32.51,52.7 22.86,52.7 19.05,48.9 13.97,48.9 JP1.8
DMX_TX  (via drill 0.4)
  Top 0.254: IC2.19 34.24,52.91 v33.53,52.2
  Bottom 0.254: v33.53,52.2 23.5,52.2 18.92,47.62 JP1.7
DO_0  (via drill 0.4)
  Top 0.254: IC2.54 46.79,36.78 47.62,35.94
  Top 0.305: 47.62,35.94 49.53,34.04 49.53,24.77 49.31,24.55
  Top 0.406: LED12.A 47.52,24.65 R93.2 49.31,24.55 49.31,23.07 v50.16,22.23
  Bottom 0.406: OK1.2 v50.16,22.23
DO_1  (via drill 0.4)
  Top 0.254: IC2.55 47.29,37.16 48.26,36.2
  Top 0.305: R94.2 53.76,24.55 53.98,24.77 53.98,30.48 48.26,36.2
  Top 0.406: LED13.A 52.6,24.65 R94.2 52.7,23.5 v51.44,22.23
  Bottom 0.406: OK1.3 v51.44,22.23
DO_2  (via drill 0.4)
  Top 0.254: IC2.56 47.79,37.55 48.9,36.45
  Top 0.305: LED14.A 55.23,24.65 54.99,24.89 54.99,30.35 48.9,36.45
  Top 0.406: LED14.A 57.69,24.65 R92.2 v57.78,22.23
  Bottom 0.406: OK2.2 v57.78,22.23
DO_3  (via drill 0.4)
  Top 0.254: IC2.57 48.29,37.94 49.53,36.7
  Top 0.305: 49.53,36.7 55.24,30.99 58.55,30.99 59.69,29.84 59.69,25.4 60.44,24.65 LED15.A
  Top 0.406: v59.05,22.23 60.96,24.13 LED15.A 62.77,24.65 R91.2
  Bottom 0.406: OK2.3 v59.05,22.23
DO_4  (via drill 0.4)
  Top 0.254: IC2.65 52.29,37.63 52.58,37.34
  Top 0.305: 52.58,37.34 56.64,33.27 62.61,33.27 67.31,28.57 67.31,26.04 68.69,24.65 LED16.A
  Top 0.406: v78.74,21.84 77.22,21.84 74.51,24.55 R102.2 72.92,24.65 LED16.A
  Bottom 0.406: OK3.2 v78.74,21.84
DO_5  (via drill 0.4)
  Top 0.254: IC2.66 52.79,38.02 52.96,37.85
  Top 0.305: 52.96,37.85 56.9,33.91 62.87,33.91 66.29,30.48 73.66,30.48 74.93,29.21 74.93,25.4 75.68,24.65 LED17.A
  Top 0.406: v81.28,21.84 79.63,23.5 78.74,23.5 78.11,24.13 R101.2 78,24.65 LED17.A
  Bottom 0.406: OK3.4 v81.28,21.84
DO_6  (via drill 0.4)
  Top 0.254: IC2.67 53.29,38.4 53.72,37.97
  Top 0.305: 53.72,37.97 57.15,34.54 63.12,34.54 66.55,31.11 78.11,31.11 80.01,29.21 80.01,25.4 80.76,24.65 LED18.A
  Top 0.406: v83.82,21.84 83.19,22.48 R100.2 83.08,24.65 LED18.A
  Bottom 0.406: OK3.6 v83.82,21.84
DO_7  (via drill 0.4)
  Top 0.254: IC2.68 53.79,38.79 54.23,38.35
  Top 0.305: 54.23,38.35 57.4,35.18 63.37,35.18 66.8,31.75 82.55,31.75 85.09,29.21 85.09,25.4 85.84,24.65 LED19.A
  Top 0.406: LED19.A 88.17,24.65 R99.2 88.27,23.75 v86.36,21.84
  Bottom 0.406: OK3.8 v86.36,21.84
GND  (via drill 0.4)
  Top 0.254: IC2.38 38.79,40.68 C18.2 | IC2.31 35.22,46.91 34.3,45.99 C17.2 | IC2.107 58.48,61.41 59.05,61.98 60.2,61.98 60.56,62.34 C26.2 | IC2.94 58.77,54.91 C24.2 | IC2.83 58.87,49.48 C23.2 | IC2.61 50.29,41.15 49.42,40.27 | IC2.51 45.29,41.23 44.96,40.89 44.32,40.89 43.96,40.53 C19.2 | IC2.16 35.51,54.41 35.31,54.61 35.31,55.88 34.81,56.37 C16.2 33.03,55.12 v32.64,55.12
  Top 0.305: IC1.15 45.4,78.42 v45.72,78.11 | 49.42,40.27 C20.2 | IC2.130 45.27,64.82 45.47,65.02 46.48,65.02 46.59,65.14 C29.2 | IC2.120 50.22,64.82 50.42,65.02 50.77,65.02 50.91,65.17 C28.2
  Top 0.406: C14.2 29.22,48.53 Q2.2 | C13.2 31.48,52.85 Q2.4
  Bottom 0.254: IC3.47 36.02,28.23 C34.2 | IC3.35 32.73,35.65 v33.15,36.07 33.23,35.98 IC3.36 | v21.84,31.37 22.73,30.48 25.02,30.48 25.27,30.73 IC3.19 27.55,30.73 v27.94,31.11 | v27.94,28.45 27.66,28.73 IC3.15 21.43,28.73 19.68,30.48 v16.89,30.48
  other vias: 60.96,54.1 55.24,44.45 38.73,44.45 42.55,44.45 51.44,44.45 46.99,44.45 55.24,48.26 38.73,48.26 42.55,48.26 51.44,48.26 46.99,48.26 55.24,52.7 38.73,52.7 42.55,52.7 51.44,52.7 46.99,52.7 55.24,57.15 38.73,57.15 42.55,57.15 51.44,57.15 46.99,57.15 55.24,61.59 38.73,60.96 42.55,60.96 50.8,61.59 46.99,60.96 28.7,58.04 32.38,45.72 47.75,65.41 28.57,47.24 52.7,66.04 62.23,62.87 62.87,61.59 60.96,49.02 36.83,40.64 37.85,35.94 29.46,33.02 32.26,28.07 32.26,30.61 30.73,29.84 34.92,26.67 38.1,28.57 42.55,32.38 40.51,30.23 40.26,35.56 43.43,35.18 43.43,38.35 27.18,36.32 22.86,38.73 20.07,37.21 16.51,32 16.51,34.16 21.84,25.78 21.84,23.88 24.77,22.86 18.41,41.27 13.97,38.73 21.59,44.45 10.16,26.67 8.26,32.38 10.16,34.29 10.79,31.75 10.16,29.21 45.72,30.48 43.18,27.94 40.01,24.77 36.83,21.59 33.66,18.41 30.48,15.24 26.67,13.97 29.21,18.03 26.67,26.67 25.65,25.53 27.05,24.38 31.5,23.5 28.57,22.48 31.11,20.32 38.35,33.66 45.72,75.56 49.53,81.92 53.34,81.92 57.15,81.92 60.96,81.92 64.77,81.92 74.93,87 76.83,90.17 76.83,93.98 76.83,97.16 78.74,99.06 82.55,99.06 86.36,99.06 88.27,97.16 88.27,93.98 88.27,90.17 88.27,86.36 88.27,82.55 88.27,78.74 88.27,74.93 88.27,71.12 88.27,67.31 88.27,63.5 88.27,59.69 88.27,55.88 88.27,52.07 88.27,48.26 83.19,93.98 83.19,90.17 83.19,86.36 80.01,95.89 80.01,92.08 80.01,88.27 86.36,84.45 68.58,81.92 71.12,78.74 66.67,74.93 60.96,80.01 62.87,78.11 66.67,78.11 83.82,83.19 65.41,73.03 61.59,69.85 59.69,69.85 62.23,72.39 57.15,71.12 59.44,73.15 52.45,71.75 55.24,73.03 50.16,73.03 46.99,73.03 40.51,71.63 42.16,73.03 38.23,70.74 36.2,73.03 32.13,73.03 29.84,60.96 31.75,62.23 17.14,46.35 8.26,41.27 10.79,46.35 10.79,48.9 10.79,41.27 10.79,43.81 17.14,43.81 17.14,51.44 10.79,51.44 27.3,53.98 27.3,56.52 27.3,58.42 28.57,55.24 18.41,38.73 14.99,37.34 24.77,41.27 21.59,41.27 27.3,45.21 24.77,43.81 24.77,47.62 24.77,50.16 21.59,47.62 26.8,39.75 21.59,53.34 21.59,57.15 21.59,60.96 21.59,64.14 21.59,70.48 21.59,73.66 24.13,76.2 28.57,80.64 26.04,78.11 28.57,78.11 31.11,80.64 28.96,72.9 24.77,73.03 24.77,70.48 28.57,70.48 31.75,70.48 34.29,69.85 34.29,67.31 36.83,66.67 32.38,78.11 34.92,79.38 56.52,79.38 59.05,78.11 24.13,66.67 29.21,64.77 27.3,62.23 24.77,59.69 24.77,55.24 24.77,63.5 71.75,83.82 76.2,72.39 82.55,69.22 71.75,66.67 76.83,66.04 79.38,62.87 79.38,57.78 79.38,52.7 79.38,47.62 79.38,42.55 79.38,37.47 69.22,35.56 59.05,42.16 60.33,40.64 60.33,38.73 59.05,37.85 60.96,50.93 64.52,49.15 60.96,55.88 66.93,61.85 65.41,60.45 73.03,60.45 62.87,38.1 19.05,50.8 19.05,54.61 19.05,58.42 19.05,61.59 15.88,58.42 12.7,55.24 15.88,55.24 19.05,67.94 19.05,71.12 19.05,74.3 20.95,76.83 23.5,79.38 26.04,81.92 22.23,81.92 18.41,81.92 14.61,81.92 12.06,80.64 8.89,77.47 5.71,74.3 2.54,71.12 1.91,67.31 1.91,63.5 1.91,59.69 1.91,55.88 1.91,52.07 1.91,48.26 1.91,44.45 1.91,40.64 1.91,36.83 1.91,33.02 1.91,29.21 5.08,28.57 1.91,26.67 5.71,25.4 5.08,32.38 7.62,36.2 11.43,38.73 5.08,38.73 6.99,52.07 6.99,55.88 10.79,59.69 14.61,63.5 6.99,62.23 8.26,71.12 17.14,78.74 13.34,74.93 14.61,71.12 13.34,67.31 49.53,38.73 77.47,69.22 79.38,83.82 74.93,82.55 74.3,78.11 76.83,80.64 78.74,78.11 80.64,80.64 80.01,73.03 88.27,44.45 69.22,60.45 71.37,61.85 69.22,68.58 66.67,66.67 73.03,73.66 73.03,69.22 62.87,29.46 57.78,29.59 52.7,29.59 48.26,29.59 73.03,29.21 78.11,29.21 83.19,29.21 88.27,29.21 60.33,31.11 50.8,31.75 68.58,29.21 80.64,30.48 85.09,33.02 76.2,29.84 71.75,33.02 80.64,33.02 76.2,33.02 64.77,35.56 67.31,33.02 56.52,37.85 68.58,48.77 73.41,55.24 72.39,35.56 69.85,39.37 64.77,40.01 69.22,26.04 64.77,26.04 61.59,22.23 64.14,22.86 66.67,38.1 66.67,24.13 72.39,46.74 36.07,25.53 48.26,33.66
  pour Top (isolate 0.305): 1.27,26.04 2.54,24.77 20.32,24.77 22.86,22.23 22.86,15.88 25.4,13.34 29.21,13.34 46.35,30.48 46.35,36.83 47.62,35.56 47.62,29.84 45.09,27.3 45.09,24.13 47.62,21.59 64.14,21.59 66.04,23.5 73.66,23.5 75.56,21.59 87,21.59 88.9,23.5 88.9,29.84 85.09,33.66 67.94,33.66 65.41,36.2 59.69,36.2 59.69,37.47 66.04,37.47 68.58,34.92 80.01,34.92 88.9,43.81 88.9,97.79 87,99.69 78.11,99.69 76.2,97.79 76.2,89.53 69.22,82.55 12.7,82.55 1.27,71.12
  pour Bottom (isolate 0.305): 1.27,26.04 2.54,24.77 20.32,24.77 22.86,22.23 22.86,15.88 25.4,13.34 29.21,13.34 46.35,30.48 46.35,36.83 47.62,35.56 47.62,29.84 45.09,27.3 45.09,24.13 47.62,21.59 64.14,21.59 66.04,23.5 73.66,23.5 75.56,21.59 87,21.59 88.9,23.5 88.9,29.84 85.09,33.66 67.94,33.66 65.41,36.2 59.69,36.2 59.69,37.47 66.04,37.47 68.58,34.92 80.01,34.92 88.9,43.81 88.9,97.79 87,99.69 78.11,99.69 76.2,97.79 76.2,89.53 69.22,82.55 12.7,82.55 1.27,71.12
GND2  (via drill 0.4)
  Top 0.254: IC4.9 38.92,13.52 v38.1,12.7
  other vias: 44.45,12.7 52.7,19.68 60.33,19.68 60.96,15.88 60.96,12.06 60.33,8.89 57.15,7.62 54.61,7.62 48.26,7.62 46.35,6.35 52.07,5.08 55.88,5.08 54.61,1.52 49.53,1.52 44.45,1.52 39.37,1.52 34.29,1.52 39.37,5.08 44.45,3.81 42.55,8.26 37.59,8.26 40.64,7.62 44.45,8.26 40.64,12.7 36.2,15.24 34.29,13.34 31.11,6.35 31.11,10.16 48.39,19.94 34.29,8.26 56.01,19.94
  pour Bottom (isolate 0.406): 31.75,0.64 30.48,1.91 30.48,10.79 41.91,22.23 45.09,22.23 46.99,20.32 60.33,20.32 61.59,19.05 61.59,9.53 59.05,6.99 59.05,2.54 57.15,0.64
  pour Top (isolate 0.406): 31.75,0.64 30.48,1.91 30.48,10.79 41.91,22.23 45.09,22.23 46.99,20.32 60.33,20.32 61.59,19.05 61.59,9.53 59.05,6.99 59.05,2.54 57.15,0.64
GND3  (via drill 0.4)
  Top 0.254: v66.04,12.7 66.86,13.52 IC5.9 66.86,15.8 67.31,16.26
  other vias: 76.2,13.34 64.14,15.24 68.58,12.7 69.85,21.59 69.85,17.78 66.04,20.32 64.14,17.78 73.66,20.95 74.93,17.14 76.2,19.68 87.63,19.68 89.53,17.78 89.53,13.97 89.53,10.16 89.53,6.35 89.15,1.52 85.09,1.52 80.01,1.52 74.93,1.52 69.85,1.52 64.77,1.52 64.77,5.08 69.85,5.08 73.66,5.08 80.01,7.62 85.09,5.08 68.58,7.62 70.48,8.26 65.53,8.26 81.28,5.08 82.55,7.62 85.09,7.62 76.2,7.62 77.47,5.08 72.39,12.7 72.39,8.26
  pour Bottom (isolate 0.406): 87.63,20.32 90.17,17.78 90.17,1.91 88.9,0.64 62.23,0.64 60.96,1.91 60.96,5.08 63.5,7.62 63.5,19.05 66.67,22.23 73.03,22.23 74.93,20.32
  pour Top (isolate 0.406): 87.63,20.32 90.17,17.78 90.17,1.91 88.9,0.64 62.23,0.64 60.96,1.91 60.96,5.08 63.5,7.62 63.5,19.05 66.67,22.23 73.03,22.23 74.93,20.32
LED_ACT  (via drill 0.4)
  Top 0.305: R51.1 22.86,17.14 | 22.86,17.14 J1.9 | v26.04,38.73 25.4,38.73 22.86,36.2 22.86,17.14
  Bottom 0.254: IC3.26 28.23,36.54 v26.04,38.73
LED_BLUE  (via drill 0.4)
  Top 0.254: IC2.2 35.37,61.41 35.18,61.59 35.18,63.25 29.84,68.58 22.86,68.58 v9.53,55.24
  Top 0.305: R28.2 v10.16,42.55
  Bottom 0.254: v10.16,42.55 8.89,43.81 8.89,54.61 v9.53,55.24
LED_GREEN  (via drill 0.4)
  Top 0.254: IC2.3 35.11,60.91 34.54,61.47 34.54,62.61 29.21,67.94 23.5,67.94 10.79,55.24 v10.79,54.61
  Top 0.305: R29.2 v10.16,45.09
  Bottom 0.254: v10.79,54.61 9.53,53.34 9.53,45.72 v10.16,45.09
LED_LINK  (via drill 0.4)
  Top 0.305: R53.1 v24.77,19.05 23.5,20.32 23.5,34.92 27.94,39.37 v28.57,39.37
  Bottom 0.254: IC3.28 29.23,38.72 v28.57,39.37
  Bottom 0.305: J1.11 14.47,17.14 22.86,17.14 v24.77,19.05
LED_RED  (via drill 0.4)
  Top 0.254: IC2.1 36.37,63.33 30.48,69.22 22.23,69.22 9.53,56.52 v8.89,56.52
  Top 0.305: R27.2 5.93,41.7 v6.35,41.27
  Bottom 0.254: v6.35,41.27 8.26,43.18 8.26,55.88 v8.89,56.52
N$1
  Top 0.305: LED11.2 4.43,43.67 4.23,43.47 R27.1
N$2
  Top 0.254: IC2.71 55.29,41.23 56.01,40.51 56.01,39.62 56.39,39.24 C25.2
N$3
  Top 0.254: IC2.106 59.78,60.91 C27.2
N$4
  Top 0.254: IC2.8 33.27,58.41 Q1.1
  Top 0.406: C11.1 32.37,59.31 Q1.1
N$5
  Top 0.254: IC2.9 33.5,57.91 Q1.2
  Top 0.406: C12.1 32.37,56.77 Q1.2
N$6
  Top 0.406: LED12.C 45.72,26.67 46.77,27.73 R54.1
N$7
  Top 0.254: IC2.23 30.38,50.91 29.46,51.82 Q2.1
  Top 0.406: C13.1 29.73,52.85 Q2.1
N$8
  Top 0.254: IC2.24 32.62,50.41 31.76,49.54 | 31.76,49.54 Q2.3 | C14.1 31.02,50.28 31.76,49.54
N$9  (via drill 0.4)
  Top 0.305: v63.5,90.17 59.22,85.89 IC1.1
  Top 0.61: v63.5,90.17 R9.2 62.38,91.92 61.91,92.39 C1.1
  Bottom 0.61: R9.2 v63.5,90.17
N$10
  Top 0.305: R28.1 7.41,43.27 6.86,43.81 5.97,43.81 5.73,44.05 LED11.3
N$11
  Top 0.406: R17.1 63.6,76.42 LED1.C
N$12  (via drill 0.4)
  Top 0.305: IC1.2 47.94,87.06 48.39,87.5 55.75,87.5 v58.42,90.17
  Top 0.61: C2.1 56.83,92.39 57.3,91.92 R10.2 v58.42,90.17
  Bottom 0.61: R10.2 v58.42,90.17
N$13
  Top 0.406: R18.1 58.52,76.42 LED2.C
N$14
  Top 0.406: R19.1 53.44,76.42 LED3.C
N$15
  Top 0.61: 63.48,94.79 R1.1
  Top 0.813: R1.1 63.5,100.97 X11.1
N$16
  Top 0.305: R29.1 6.6,45.09 6.2,45.48 LED11.4
N$17
  Top 0.406: R20.1 48.36,76.42 LED4.C
N$18
  Top 0.61: 58.4,94.79 R2.1
  Top 0.813: R2.1 58.42,100.97 X10.2
N$19  (via drill 0.4)
  Top 0.305: IC1.3 47.31,87.69 48.01,88.39 51.56,88.39 v53.34,90.17
  Top 0.61: v53.34,90.17 R11.2 52.22,91.92 51.75,92.39 C3.1
  Bottom 0.61: R11.2 v53.34,90.17
N$20
  Top 0.61: 53.32,94.79 R3.1
  Top 0.813: R3.1 53.34,100.97 X10.1
N$21  (via drill 0.4)
  Top 0.305: IC1.4 46.67,88.58 v48.26,90.17
  Top 0.61: v48.26,90.17 R12.2 47.14,91.92 46.67,92.39 C4.1
  Bottom 0.61: R12.2 v48.26,90.17
N$22
  Top 0.61: 48.24,94.79 R4.1
  Top 0.813: R4.1 48.26,100.97 X3.2
N$23  (via drill 0.4)
  Top 0.305: IC1.7 44.77,88.58 v43.18,90.17
  Top 0.61: v43.18,90.17 R13.2 42.06,91.92 41.59,92.39 C5.1
  Bottom 0.61: R13.2 v43.18,90.17
N$24
  Top 0.813: 43.16,94.79 R5.1 43.18,100.97 X3.1
N$25  (via drill 0.4)
  Top 0.305: IC1.8 44.13,87.95 43.05,89.03 39.24,89.03 v38.1,90.17
  Top 0.61: v38.1,90.17 R14.2 36.98,91.92 36.51,92.39 C6.1
  Bottom 0.61: R14.2 v38.1,90.17
N$26
  Top 0.61: 38.08,94.79 R6.1
  Top 0.813: R6.1 38.1,100.97 X2.2
N$27  (via drill 0.4)
  Top 0.305: IC1.9 43.5,87.31 42.8,88.01 35.18,88.01 v33.02,90.17
  Top 0.61: v33.02,90.17 R15.2 31.9,91.92 31.43,92.39 C7.1
  Bottom 0.61: R15.2 v33.02,90.17
N$28
  Top 0.61: 33,94.79 R7.1
  Top 0.813: R7.1 33.02,100.97 X2.1
N$29  (via drill 0.4)
  Top 0.305: IC1.10 42.86,86.68 42.55,87 31.11,87 v27.94,90.17
  Top 0.61: v27.94,90.17 R16.2 26.82,91.92 26.35,92.39 C8.1
  Bottom 0.61: R16.2 v27.94,90.17
N$30
  Top 0.61: 27.92,94.79 R8.1
  Top 0.813: R8.1 27.94,100.97 X1.2
N$31
  Top 0.406: R26.2 LED10.A
N$32
  Top 0.406: R21.1 43.08,76.42 LED5.C
N$33
  Top 0.406: R22.1 38,76.42 LED6.C
N$34
  Top 0.406: R23.1 32.92,76.42 LED7.C
N$35
  Top 0.406: R24.1 26.14,76.31 LED8.C
N$36
  Top 0.406: LED13.C 50.8,26.67 50.97,26.84 R55.1
N$37
  Top 0.406: LED14.C 55.88,26.67 56.05,26.84 R56.1
N$38
  Top 0.406: LED15.C 60.96,26.67 61.13,26.84 R57.1
N$39
  Top 0.406: J1.5 16.51,9.53 J1.4 14.61,6.35 10.79,6.35 7.62,9.53 R48.2
N$40
  Top 0.406: R49.2 10.16,12.06 11.43,10.79 | 11.43,10.79 J1.7 | J1.8 11.43,10.79
N$41
  Top 0.406: T1.15 19.68,20.95 17.53,23.11 R47.2
N$42
  Top 0.406: R25.2 LED9.A
N$43
  Top 0.406: R46.2 12.83,21.21 13.34,20.7 T1.10
N$44
  Top 0.406: R48.1 R49.1 4.23,13.76 6.48,16 C44.1 6.48,18.92 6.77,19.21 R46.1 R47.1
N$45  (via drill 0.4)
  Top 0.305: R52.1 v24.77,20.95
  Bottom 0.305: v24.77,20.95 21.59,17.78 12.56,17.78 J1.12
N$46
  Top 0.305: J1.10 20.45,13.97 22.23,13.97 23.5,15.24 R50.1
N$47
  Top 0.406: LED16.C 71.12,26.67 71.29,26.84 R58.1
N$48
  Top 0.406: LED17.C 76.2,26.67 76.37,26.84 R59.1
N$49
  Top 0.406: LED18.C 81.28,26.67 81.45,26.84 R60.1
N$50
  Top 0.406: LED19.C 86.36,26.67 86.53,26.84 R61.1
N$51
  Top 0.406: T1.2 19.68,26.04 19.05,25.4 13.34,25.4 | T1.7 13.34,25.4 | R45.1 C42.1 C43.1 8.47,25.82 8.89,25.4 13.34,25.4
N$52
  Bottom 0.254: IC3.21 24.66,31.73 22.64,33.74 R35.1
N$53
  Bottom 0.254: IC3.20 24.27,31.23 21.59,33.91 21.59,36.2 22.23,36.83 R36.1
N$54
  Bottom 0.254: IC3.24 26.04,33.52 R34.1
N$55
  Top 0.406: R41.2 20.32,29.84 20.95,29.21 T1.1
N$56
  Top 0.406: T1.3 R43.2
N$57
  Top 0.406: R42.2 T1.6
N$58
  Top 0.406: R44.2 12.7,29.84 12.06,29.21 T1.8
N$59
  Bottom 0.254: IC3.34 32.23,35.72 31.75,36.2 31.75,38.1 32.55,38.9
  Bottom 0.305: 32.55,38.9 OS1.3
N$60  (via drill 0.4)
  Top 0.305: R33.1 30.27,38.1 v27.94,38.1
  Bottom 0.254: IC3.27 28.73,37.31 v27.94,38.1
N$61
  Bottom 0.254: IC3.39 35.66,32.23 39.37,35.94 R30.1
N$62
  Bottom 0.254: IC3.6 30.73,25.14 30.06,24.47 R32.2
N$63
  Top 0.406: SV1.8 SV1.7 76.2,74.3 74.3,72.39 JP3.2
N$64
  Bottom 0.305: R71.1 76.2,62.87 JP2.2
N$65
  Top 0.254: R72.1 70.48,59.05 71.75,57.78 76.2,57.78 JP2.8
N$66
  Top 0.254: R73.1 70.48,55.24 73.03,52.7 76.2,52.7 JP2.12
N$67
  Top 0.254: R74.1 70.48,52.7 73.03,50.16 76.2,50.16 JP2.14
N$68
  Top 0.254: R75.1 70.48,51.44 74.3,47.62 76.2,47.62 JP2.16
N$69
  Top 0.254: R76.1 69.85,46.35 73.66,42.55 76.2,42.55 JP2.20
N$70
  Top 0.254: R77.1 69.85,43.81 73.66,40.01 76.2,40.01 JP2.22
N$71  (via drill 0.4)
  Top 0.305: v73.03,65.41 75.56,65.41 76.2,64.77 76.2,62.87 JP2.3
  Bottom 0.305: R63.2 v73.03,65.41
N$72
  Bottom 0.305: R62.2 JP2.1
N$73
  Top 0.254: R64.2 70.48,57.78 71.75,56.52 JP2.7
N$74
  Top 0.254: R65.2 70.48,56.52 73.03,53.98 JP2.9
N$75
  Top 0.254: R66.2 70.48,53.98 73.03,51.44 JP2.11
N$76
  Top 0.254: R67.2 70.48,50.16 74.3,46.35 JP2.15
N$77
  Top 0.254: R68.2 69.85,47.62 73.66,43.81 JP2.17
N$78
  Top 0.254: R69.2 69.85,45.09 73.66,41.27 JP2.19
N$79
  Top 0.254: R70.2 69.85,41.27 72.39,38.73 72.39,37.47 73.66,36.2 JP2.23
N$80
  Top 0.254: R78.1 69.85,42.55 73.03,39.37 73.03,38.1 73.66,37.47 76.2,37.47 JP2.24
N$81
  Bottom 0.406: OK1.7 50.16,16.51 49.53,15.88 49.53,12.7 49.74,12.48 R79.1 R83.1
N$82  (via drill 0.4)
  Top 0.406: Q3.7 v50.8,15.24
  Bottom 0.406: v50.8,15.24 R79.2
N$83
  Bottom 0.406: OK1.6 51.44,16.51 52.07,15.88 52.07,12.7 52.28,12.48 R80.1 R84.1
N$84
  Bottom 0.406: OK2.7 57.78,16.51 57.15,15.88 57.15,12.7 56.94,12.48 R81.1 R85.1
N$85
  Bottom 0.406: OK2.6 59.05,16.51 59.69,15.88 59.69,12.7 59.48,12.48 R82.1 R86.1
N$86  (via drill 0.4)
  Top 0.406: Q3.5 v53.34,15.24
  Bottom 0.406: v53.34,15.24 R80.2
N$87  (via drill 0.4)
  Top 0.406: Q3.3 v55.88,15.24
  Bottom 0.406: v55.88,15.24 R81.2
N$88  (via drill 0.4)
  Top 0.406: Q3.1 v58.42,15.24
  Bottom 0.406: v58.42,15.24 R82.2
N$89
  Bottom 0.406: OK1.1 R87.2
N$90
  Bottom 0.406: OK1.4 R88.2
N$91
  Bottom 0.406: OK2.1 R89.2
N$92
  Bottom 0.406: OK2.4 R90.2
N$93
  Bottom 0.406: R95.2 OK3.1
N$94
  Bottom 0.406: R96.2 OK3.3
N$95
  Bottom 0.406: R97.2 OK3.5
N$96
  Bottom 0.406: R98.2 OK3.7
N$97  (via drill 0.4)
  Top 0.406: Q4.7 v78.74,15.24
  Bottom 0.406: v78.74,15.24 R103.2
N$98  (via drill 0.4)
  Top 0.406: Q4.5 v81.28,15.24
  Bottom 0.406: v81.28,15.24 R104.2
N$99  (via drill 0.4)
  Top 0.406: Q4.3 v83.82,15.24
  Bottom 0.406: v83.82,15.24 R105.2
N$100  (via drill 0.4)
  Top 0.406: Q4.1 v86.36,15.24
  Bottom 0.406: v86.36,15.24 R106.2
N$101
  Bottom 0.406: R108.1 R105.1 82.77,12.48 82.55,12.7 OK3.12
N$102
  Bottom 0.406: OK3.14 80.01,12.7 80.22,12.48 R104.1 R109.1
N$103
  Bottom 0.406: OK3.16 77.47,12.7 77.69,12.48 R103.1 R110.1
N$104
  Bottom 0.406: R107.1 R106.1 85.31,12.48 85.09,12.7 OK3.10
N$105
  Top 0.254: IC4.3 39.44,9.18 R111.2
N$106
  Top 0.254: 38.4,16.55 IC4.10
  Top 0.61: L3.1 40.01,19.68 38.4,18.07 38.4,16.55
N$107
  Top 0.254: 40.98,10.46 IC4.5
  Top 0.406: R114.2 R113.1 41.49,9.95 40.98,10.46
N$108
  Top 0.254: 40.98,14.94 IC4.6
  Top 0.406: C48.1 R112.1 41.62,15.58 40.98,14.94
N$109
  Top 0.254: IC5.3 67.38,9.18 R115.2
N$110
  Top 0.254: 66.33,16.64 IC5.10
  Top 0.61: L2.1 67.31,19.68 66.33,18.71 66.33,16.64
N$111
  Top 0.254: 68.92,10.46 IC5.5
  Top 0.406: R118.2 R117.1 69.43,9.95 68.92,10.46
N$112
  Top 0.254: 68.92,14.94 IC5.6
  Top 0.406: 68.92,14.94 69.56,15.58 R116.1
  Top 0.61: C51.1 R116.1
NRST  (via drill 0.4)
  Top 0.254: IC2.25 33.65,49.91 32.89,49.15 32.89,47.75 31.36,46.21 C21.1 | v29.21,45.72 29.21,46.21
  Top 0.305: v29.21,62.23 26.04,59.05 26.04,48.26 28.08,46.21 29.21,46.21 C21.1
  Top 0.406: S1.3 S1.4 81.57,82.2 81.28,81.92 | v45.47,68.33 62.61,68.33 76.2,81.92 81.28,81.92 | 81.28,81.92 SV1.1
  Bottom 0.254: IC3.29 29.73,40.76 29.21,41.27 v29.21,45.72
  Bottom 0.305: v29.21,62.23 30.48,63.5 43.81,63.5 44.45,64.14 44.45,67.31 v45.47,68.33
OUT1.1
  Top 0.508: 58.42,8.26 Q3.18
  Top 0.61: X6.1 58.42,4.4 58.42,8.26
OUT1.2
  Top 0.508: 55.88,8.26 Q3.16
  Top 0.61: X6.2 55.88,6.94 55.88,8.26
OUT1.3
  Top 0.508: 53.34,8.26 Q3.14
  Top 0.61: X5.1 48.23,3.15 53.34,8.26
OUT1.4
  Top 0.508: Q3.12 50.8,8.26
  Top 0.61: 50.8,8.26 47.62,5.08 43.86,5.08 X5.2
OUT2.1
  Top 0.508: 86.36,8.26 Q4.18
  Top 0.61: X9.1 86.36,4.44 86.36,8.26
OUT2.2
  Top 0.508: 83.82,8.26 Q4.16
  Top 0.61: X9.2 83.82,4.4 83.82,8.26
OUT2.3
  Top 0.508: 81.28,8.26 Q4.14
  Top 0.61: X8.1 81.28,6.94 81.28,8.26
OUT2.4
  Top 0.508: 78.74,8.26 Q4.12
  Top 0.61: X8.2 73.64,3.15 78.74,8.26
PE  (via drill 0.4)
  other vias: 3.81,20.32 3.17,15.88 1.91,17.78 2.54,12.06 2.54,7.62 2.54,3.17 6.35,1.91 6.35,7.62 12.06,5.08 13.97,1.91 17.78,1.91 15.88,5.08 19.68,5.08 25.4,1.91 25.4,8.26 20.95,12.7 13.34,13.34 10.16,13.34 7.62,13.97 10.16,19.05 8.26,16.51 7.62,10.79 9.53,10.16 22.23,8.89
  pour Top (isolate 0.61): 21.59,14.61 26.67,9.53 26.67,0.64 3.81,0.64 1.27,3.17 1.27,22.23 2.54,23.5 20.32,23.5 21.59,22.23
  pour Bottom (isolate 0.61): 21.59,14.61 26.67,9.53 26.67,0.64 3.81,0.64 1.27,3.17 1.27,22.23 2.54,23.5 19.05,23.5 21.59,20.95
PFB  (via drill 0.4)
  Top 0.254: v28.07,29.84 26.25,29.84 C39.1
  Top 0.305: v32.89,32.89 31.34,31.34 C36.+ | C38.1 27.73,32.85 v27.81,32.77 29.23,31.34 C36.+ | v28.07,29.84 28.7,29.84 29.59,30.73 C36.+
  Bottom 0.254: C40.1 36.41,33.87 35.77,33.23 IC3.37 33.23,33.23 v32.89,32.89 | IC3.18 27.68,30.23 v28.07,29.84 | IC3.23 27.78,32.73 v27.81,32.77
RD_N  (via drill 0.4)
  Top 0.254: R40.1 v12.7,33.02 R44.1
  Bottom 0.254: IC3.13 17.38,27.73 13.46,31.64 13.46,32.64 13.08,33.02 v12.7,33.02 12.7,33.66 14.48,35.44 D1.4
RD_P  (via drill 0.4)
  Top 0.254: R39.1 v14.61,33.02 R42.1
  Bottom 0.254: IC3.14 17.59,28.23 13.97,31.86 13.97,32.64 14.35,33.02 v14.61,33.02 14.72,33.14 D1.3
RMII_CRS_DV  (via drill 0.4)
  Top 0.254: IC2.43 41.29,35.19 38.48,32.38 37.47,32.38 v36.83,31.75
  Bottom 0.254: IC3.40 36.81,31.73 v36.83,31.75
RMII_MDC  (via drill 0.4)
  Top 0.305: IC2.27 34.94,48.91 v34.92,48.9
  Bottom 0.254: IC3.31 30.73,40.89 34.92,45.09 v34.92,48.9
RMII_MDIO  (via drill 0.4)
  Top 0.305: IC2.36 36.37,43.98 34.29,41.91 v30.48,41.91 28.19,41.91 28.03,42.08 R31.2
  Bottom 0.254: IC3.30 30.23,41.66 v30.48,41.91
RMII_RXD0  (via drill 0.4)
  Top 0.254: IC2.44 41.79,34.8 v38.1,31.11
  Bottom 0.254: IC3.43 37.22,30.23 v38.1,31.11
RMII_RXD1  (via drill 0.4)
  Top 0.254: IC2.45 42.29,34.42 40.01,32.13 v40.01,31.5
  Bottom 0.254: IC3.44 38.24,29.73 v40.01,31.5
RMII_TX_EN  (via drill 0.4)
  Top 0.254: IC2.70 54.79,40.31 v54.86,40.26 | v35.56,22.61 35.56,24.38 v34.54,25.4
  Bottom 0.254: v54.86,40.26 53.85,41.27 48.01,41.27 45.85,39.12 45.85,32.13 36.32,22.61 v35.56,22.61 | IC3.2 32.73,25.31 33.02,25.02 33.66,25.02 34.04,25.4 v34.54,25.4
RMII_TXD0  (via drill 0.4)
  Top 0.254: IC2.73 57.62,43.65 v57.15,43.18
  Bottom 0.254: v57.15,43.18 56.52,42.55 47.24,42.55 44.58,39.88 44.58,32.38 36.32,24.13 33.15,24.13 32.23,25.05 IC3.3
RMII_TXD1  (via drill 0.4)
  Top 0.254: IC2.74 58.52,44.98 59.05,44.45 v59.05,43.81
  Bottom 0.254: v59.05,43.81 57.15,41.91 47.62,41.91 45.21,39.5 45.21,32.26 36.45,23.5 33.02,23.5 31.73,24.79 IC3.4
RX_N
  Top 0.254: J1.6 13.97,11.18 14.99,12.19 14.99,15.37 12.06,18.29 T1.9
RX_P
  Top 0.254: J1.3 16.89,10.79 15.49,12.19 15.49,15.62 13.97,17.14 13.97,17.65 14.61,18.29 T1.11
SPI_MISO  (via drill 0.4)
  Top 0.254: IC2.112 54.22,63.01 54.61,62.61 56.26,62.61 v57.02,63.37
  Bottom 0.254: v57.02,63.37 57.4,63.75 63.25,63.75 64.14,62.87 R71.2
SPI_MOSI  (via drill 0.4)
  Top 0.254: IC2.113 53.72,65.14 v53.98,65.41
  Bottom 0.254: v53.98,65.41 54.36,65.41 55.5,64.26 64.01,64.26 64.14,64.14 R62.1
SPI_SCK  (via drill 0.4)
  Top 0.254: IC2.111 54.72,64.88 v55.5,65.66
  Bottom 0.254: v55.5,65.66 55.88,65.66 56.77,64.77 63.5,64.77 64.14,65.41 R63.1
SWCLK
  Top 0.305: IC2.109 55.72,64.61 57.78,66.67 63.5,66.67
  Top 0.406: SV1.6 83.82,75.56 72.39,75.56 63.5,66.67
SWDIO
  Top 0.254: IC2.105 58.47,60.41 59.18,59.69
  Top 0.406: SV1.2 87,80.01 87,71.12 83.82,67.94 71.12,67.94 62.87,59.69 59.18,59.69
SWO
  Top 0.254: IC2.133 43.79,66.65 44.45,67.31
  Top 0.305: 44.45,67.31 62.87,67.31
  Top 0.406: 62.87,67.31 72.39,76.83 SV1.5
TD_N  (via drill 0.4)
  Top 0.305: R38.1 v18.41,33.02 R43.1
  Bottom 0.254: IC3.16 21.72,29.23 19.18,31.77 19.18,32.64 18.8,33.02 v18.41,33.02 18.3,33.14 D1.1
TD_P  (via drill 0.4)
  Top 0.305: R37.1 v20.32,33.02 R41.1
  Bottom 0.254: IC3.17 21.94,29.73 19.68,31.98 19.68,32.64 20.07,33.02 v20.32,33.02 20.32,33.66 18.54,35.44 D1.6
TX_N
  Top 0.254: J1.2 19.05,12.34 17.02,14.37 17.02,16.36 18.41,17.76 T1.14
TX_P
  Top 0.254: 20.95,19.33 T1.16 20.95,18.16 20.45,17.65 19.05,17.65 17.53,16.13 17.53,14.58 19.56,12.55 19.56,11.56 J1.1
VBAT
  Top 0.254: IC2.6 34.45,59.41 33.51,60.34 C30.1
  Top 0.406: C30.1 33.51,62.37 29.21,66.67 G1.+
VDDA
  Top 0.254: IC2.32 IC2.33 35.24,45.91 35.05,45.72 35.05,44.83 34.67,44.45 C32.1 33.9,43.04 L1.1